# EAGLE design voltametry (EAGLE 7.7.0)
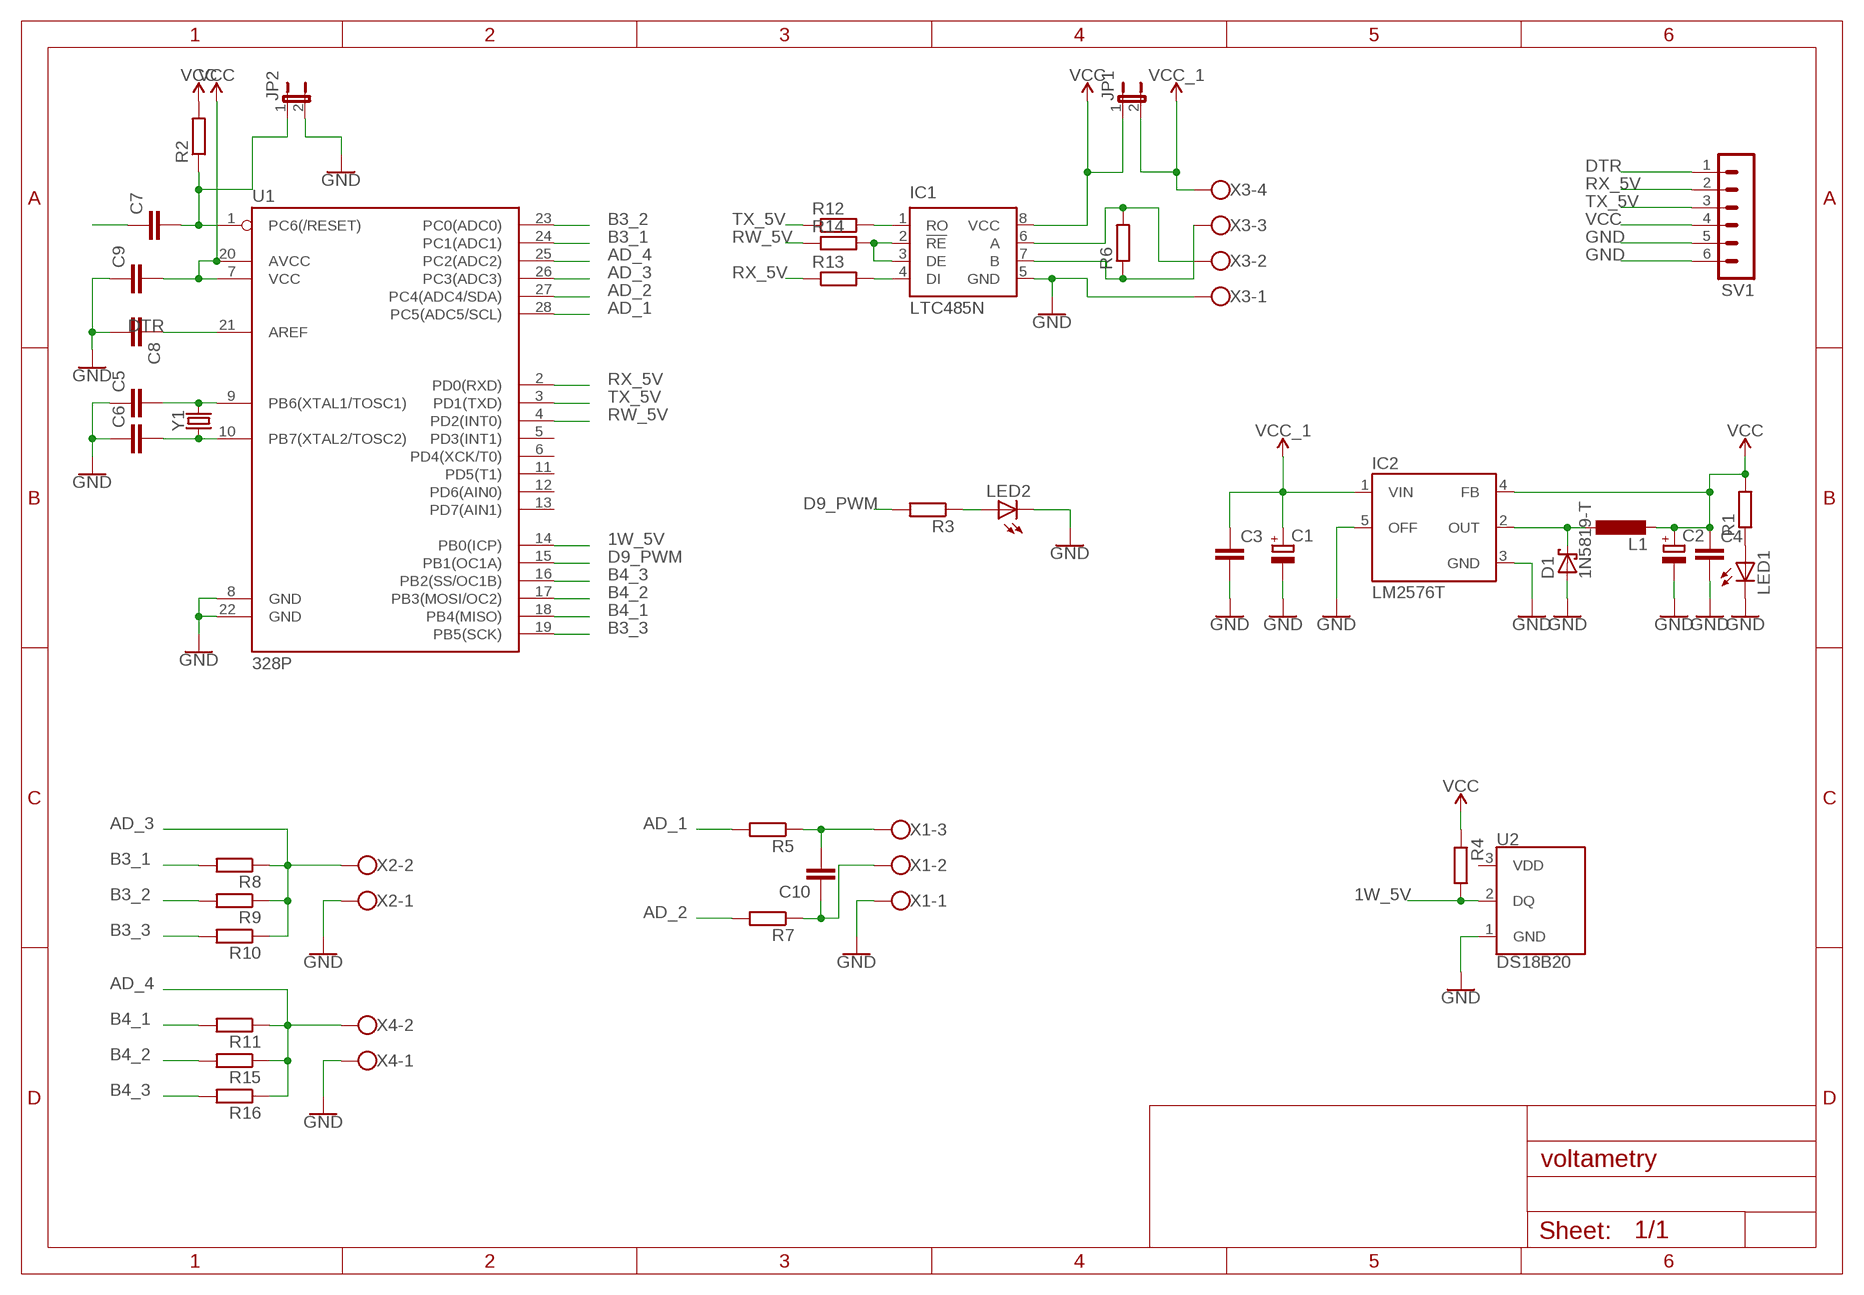
[diagram p0: schematic, sheet 1]

## Parts
C1  CPOL-EUE5-10.5  [E5-10,5]
C2  CPOL-EUE5-10.5  [E5-10,5]
C3  C-EU025-025X050  [C025-025X050]
C4  C-EU025-025X050  [C025-025X050]
C5  C-EU025-025X050  [C025-025X050]
C6  C-EU025-025X050  [C025-025X050]
C7  C-EU025-025X050  [C025-025X050]
C8  C-EU025-025X050  [C025-025X050]
C9  C-EU025-025X050  [C025-025X050]
C10  C-EU025-025X050  [C025-025X050]
D1  1N5819-T  [DO41-7.6]
IC1  LTC485N  [DIL08]
IC2  LM2576T  [TO220-5]
JP1  JP1E  [JP1]
JP2  JP1E  [JP1]
L1  L-EUTJ3-U1  [TJ3-U1]
LED1  LED5MM  [LED5MM]
LED2  LED5MM  [LED5MM]
R1  R-EU_0204/7  [0204/7]
R2  R-EU_0204/7  [0204/7]
R3  R-EU_0204/7  [0204/7]
R4  R-EU_0204/7  [0204/7]
R5  R-EU_0204/7  [0204/7]
R6  R-EU_0204/7  [0204/7]
R7  R-EU_0204/7  [0204/7]
R8  R-EU_0204/7  [0204/7]
R9  R-EU_0204/7  [0204/7]
R10  R-EU_0204/7  [0204/7]
R11  R-EU_0204/7  [0204/7]
R12  R-EU_0204/7  [0204/7]
R13  R-EU_0204/7  [0204/7]
R14  R-EU_0204/7  [0204/7]
R15  R-EU_0204/7  [0204/7]
R16  R-EU_0204/7  [0204/7]
SV1  MA06-1  [MA06-1]
U1  328P  ATMEGA328P_PDIP  [DIP28]
U2  DS18B20  [TO-92-AMMO]
X1  W237-103  [W237-103]
X2  W237-102  [W237-102]
X3  W237-4  [W237-4]
X4  W237-102  [W237-102]
Y1  CRYSTALPTH-HC49US  [HC49US]

## Nets
1W_5V: R4.2 U1.14(PB0(ICP)) U2.2(DQ)
AD_1: R5.2 U1.28(PC5(ADC5/SCL))
AD_2: R7.2 U1.27(PC4(ADC4/SDA))
AD_3: R8.1 R9.1 R10.1 U1.26(PC3(ADC3)) X2.2
AD_4: R11.1 R15.1 R16.1 U1.25(PC2(ADC2)) X4.2
B3_1: R8.2 U1.24(PC1(ADC1))
B3_2: R9.2 U1.23(PC0(ADC0))
B3_3: R10.2 U1.19(PB5(SCK))
B4_1: R11.2 U1.18(PB4(MISO))
B4_2: R15.2 U1.17(PB3(MOSI/OC2))
B4_3: R16.2 U1.16(PB2(SS/OC1B))
D9_PWM: R3.2 U1.15(PB1(OC1A))
DTR: C7.1 SV1.1
GND: C1.- C2.- C3.2 C4.2 C5.1 C6.1 C8.2 C9.1 D1.A IC1.5(GND) IC2.3(GND) IC2.5(OFF) JP2.2 LED1.K(C) LED2.K(C) SV1.5 SV1.6 U1.8(GND) U1.22(GND) U2.1(GND) X1.1 X2.1 X3.1 X4.1
N$1: LED1.A R1.1
N$2: C5.2 U1.9(PB6(XTAL1/TOSC1)) Y1.2
N$3: C6.2 U1.10(PB7(XTAL2/TOSC2)) Y1.1
N$4: IC1.4(DI) R13.2
N$5: IC1.7(B) R6.1 X3.3
N$6: C8.1 U1.21(AREF)
N$7: LED2.A R3.1
N$8: IC1.1(RO) R12.2
N$9: D1.C IC2.2(OUT) L1.1
N$10: C7.2 JP2.1 R2.1 U1.1(PC6(/RESET))
N$11: IC1.6(A) R6.2 X3.2
N$13: IC1.2(!RE) IC1.3(DE) R14.2
N$15: C10.1 R7.1 X1.2
N$16: C10.2 R5.1 X1.3
RW_5V: R14.1 U1.4(PD2(INT0))
RX_5V: R13.1 SV1.2 U1.2(PD0(RXD))
TX_5V: R12.1 SV1.3 U1.3(PD1(TXD))
VCC: C2.+ C4.1 C9.2 IC1.8(VCC) IC2.4(FB) JP1.1 L1.2 R1.2 R2.2 R4.1 SV1.4 U1.7(VCC) U1.20(AVCC)
VCC_1: C1.+ C3.1 IC2.1(VIN) JP1.2 X3.4
Unconnected: U1.5(PD3(INT1)) U1.6(PD4(XCK/T0)) U1.11(PD5(T1)) U1.12(PD6(AIN0)) U1.13(PD7(AIN1))

## Power pins joined to a net without a drawn wire
VDD: U2.3(VDD)

## Library data of the parts
C1 C2 = rcl:CPOL-EU: POLARIZED CAPACITOR, European symbol
C3-C10 = rcl:C-EU: CAPACITOR, European symbol
D1 = diode:1N581*: 1.0A SCHOTTKY BARRIER RECTIFIER Source: http://www.diodes.com/datasheets/ds23001.pdf
IC1 = linear-technology:LTC485: Low Power RS485 Interface Transceiver Source: http://www.linear.com/pc/downloadDocument.do?navId=H0,C1,C1007,C1017,P2064,D1718; OC_FARNELL: unknown; OC_NEWARK: unknown
IC2 = v-reg-3:LM2576: National Semiconductor <http://www.national.com> 3.0A "Simple Switcher"(c) 52kHz, Vout 1.23-37V (HV: 57V), Vin 40V (HV: 60V), 50µA standby current
JP1 JP2 = jumper:JP1E: JUMPER
L1 = resistor:L-EU: INDUCTOR, European symbol
LED1 LED2 = led:LED: LED OSRAM: - CHIPLED LG R971, LG N971, LY N971, LG Q971, LY Q971, LO R971, LY R971 LH N974, LH R974 LS Q976, LO Q976, LY Q976 LO Q996 - Hyper CHIPLED LW Q18S LB Q993, LB Q99A, LB R99A - SideLED LS A670, LO A670, LY A670, LG A670, LP A670 LB A673, LV A673, LT A673, LW A673 LH A674 LY A675 LS A676, LA A676, LO A676, LY A676, LW A676 LS A679, LY A679, LG A679 - Hyper Micro SIDELED® LS Y876, LA Y876, LO Y876, LY Y876 LT Y87S - SmartLED LW L88C, LW L88S LB L89C, LB L89S, LG L890 LS L89K, LO L89K, LY L89K LS L896, LA L896, LO L896, LY L896 - TOPLED LS T670, LO T670, LY T670, LG T670, LP T670 LSG T670, LSP T670, LSY T670, LOP T670, LYG T670 LG T671, LOG T671, LSG T671 LB T673, LV T673, LT T673, LW T673 LH T674 LS T676, LA T676, LO T676, LY T676, LB T676, LH T676, LSB T676, LW T676 LB T67C, LV T67C, LT T67C, LS T67K, LO T67K, LY T67K, LW E67C LS E67B, LA E67B, LO E67B, LY E67B, LB E67C, LV E67C, LT E67C LW T67C LS T679, LY T679, LG T679 LS T770, LO T770, LY T770, LG T770, LP T770 LB T773, LV T773, LT T773, LW T773 LH T774 LS E675, LA E675, LY E675, LS T675 LS T776, LA T776, LO T776, LY T776, LB T776 LHGB T686 LT T68C, LB T68C - Hyper Mini TOPLED® LB M676 - Mini TOPLED Santana® LG M470 LS M47K, LO M47K, LY M47K Source: http://www.osram.convergy.de LUXEON: - LUMILED® LXK2-PW12-R00, LXK2-PW12-S00, LXK2-PW14-U00, LXK2-PW14-V00 LXK2-PM12-R00, LXK2-PM12-S00, LXK2-PM14-U00 LXK2-PE12-Q00, LXK2-PE12-R00, LXK2-PE12-S00, LXK2-PE14-T00, LXK2-PE14-U00 LXK2-PB12-K00, LXK2-PB12-L00, LXK2-PB12-M00, LXK2-PB14-N00, LXK2-PB14-P00, LXK2-PB14-Q00 LXK2-PR12-L00, LXK2-PR12-M00, LXK2-PR14-Q00, LXK2-PR14-R00 LXK2-PD12-Q00, LXK2-PD12-R00, LXK2-PD12-S00 LXK2-PH12-R00, LXK2-PH12-S00 LXK2-PL12-P00, LXK2-PL12-Q00, LXK2-PL12-R00 Source: www.luxeon.com KINGBRIGHT: KA-3528ASYC Source: www.kingbright.com
R1-R16 = rcl:R-EU_: RESISTOR, European symbol
SV1 = con-lstb:MA06-1: PIN HEADER; OC_FARNELL: unknown; OC_NEWARK: unknown
U1 = SparkFun-IC-Microcontroller:ATMEGA328P_PDIP: Atmel 328P Through hole ATMEGA328P uC used in the Arduino 32kb flash, 1k EEPROM, 2k SRAM Datasheet <http://www.sparkfun.com/datasheets/Components/SMD/ATMega328.pdf> SparkFun Products Storefront component: AVR 28 Pin 20MHz 32K 6A/D - ATMega328P <https://www.sparkfun.com/products/9061> (COM-09061) SparkFun Simon Says - Through-Hole Soldering Kit <https://www.sparkfun.com/products/10547> (KIT-10547) SparkFun Learn to Solder - Simon Says <https://www.sparkfun.com/products/13708> (KIT-13708) SparkFun BigTime Watch Kit <https://www.sparkfun.com/products/11734> (KIT-11734) SparkFun ClockIt <https://www.sparkfun.com/products/10930> (KIT-10930) SparkFun Serial Enabled LCD Kit <https://www.sparkfun.com/products/10097> (LCD-10097) SparkFun Simon Tilts - Through Hole Soldering Kit <https://www.sparkfun.com/products/12634> (KIT-12634) SparkFun Frequency Counter Kit <https://www.sparkfun.com/products/10140> (KIT-10140) FabFM Radio Kit <https://www.sparkfun.com/products/11043> (KIT-11043) SparkFun Binary Blaster Kit <https://www.sparkfun.com/products/12037> (KIT-12037) SparkFun Metro-Gnome <https://www.sparkfun.com/products/9236> (KIT-09236) ATmega328 with Arduino Optiboot (Uno) <https://www.sparkfun.com/products/10524> (DEV-10524); PROD_ID: IC-09136
U2 = SparkFun-Sensors:DS18B20: Dallas/Maxim DS18B20 1-Wire Temperature Sensor The DS18B20 reports degrees C with 9 to 12-bit precision, -55C to 125C (+/-0.5C). Each sensor has a unique 64-Bit Serial number etched into it - allows for a huge number of sensors to be used on one data bus. Datasheet <http://datasheets.maximintegrated.com/en/ds/DS18B20.pdf> SparkFun Products One Wire Digital Temperature Sensor - DS18B20 <https://www.sparkfun.com/products/245> (SEN-00245); STORE_ID: SEN-00245
X1 = con-wago-500:W237-103: WAGO SCREW CLAMP; MPN: 237-103; OC_FARNELL: unknown; OC_NEWARK: 18M7116
X2 X4 = con-wago-500:W237-102: WAGO SCREW CLAMP; MPN: 237-102; OC_FARNELL: unknown; OC_NEWARK: 70K9898
X3 = con-wago-500:W237-4: WAGO SCREW CLAMP; OC_FARNELL: unknown; OC_NEWARK: unknown
Y1 = SparkFun-Clocks:CRYSTAL: Crystals (Generic) These are passive quartz crystals, which can be used as a clock source for a microcontroller. Crystal's are two-terminal devices. They require external "load" capacitors to generate an oscillating signal.

## Board
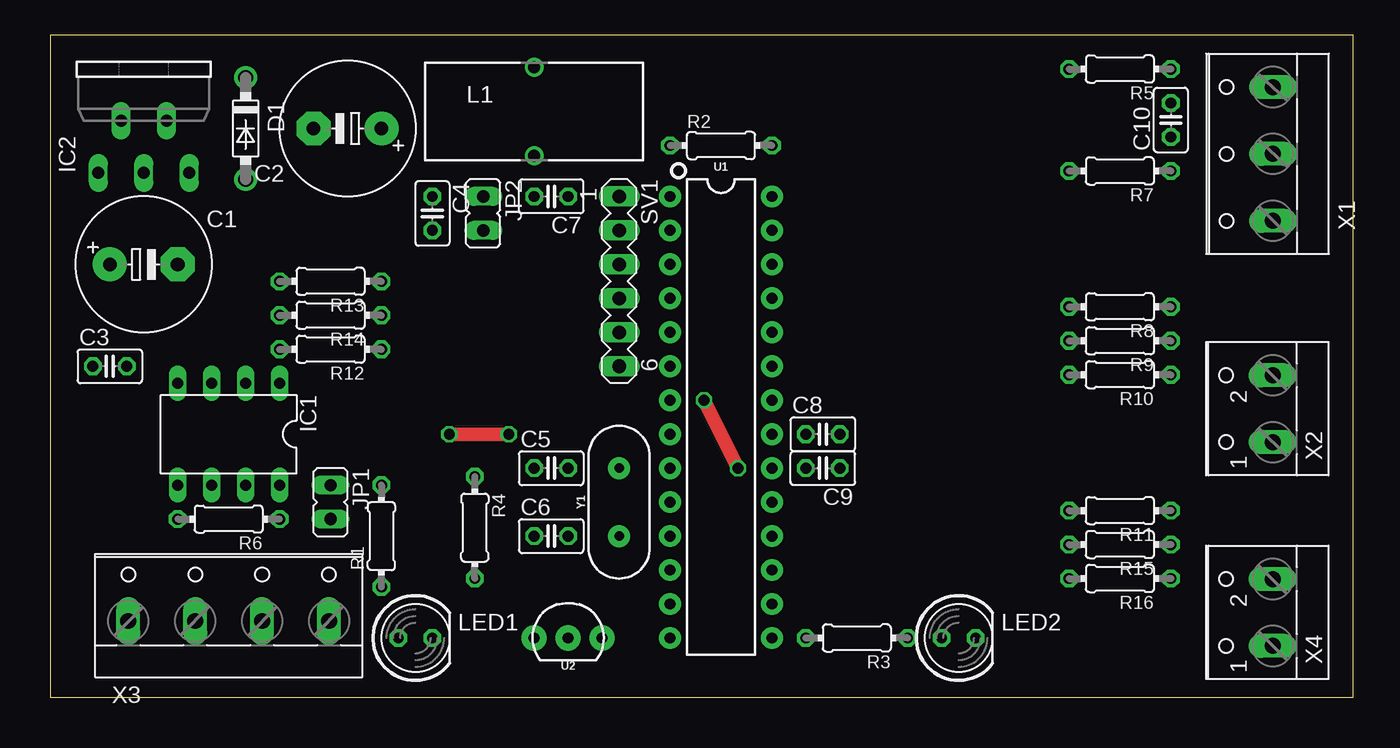
[diagram p1: board, top side]
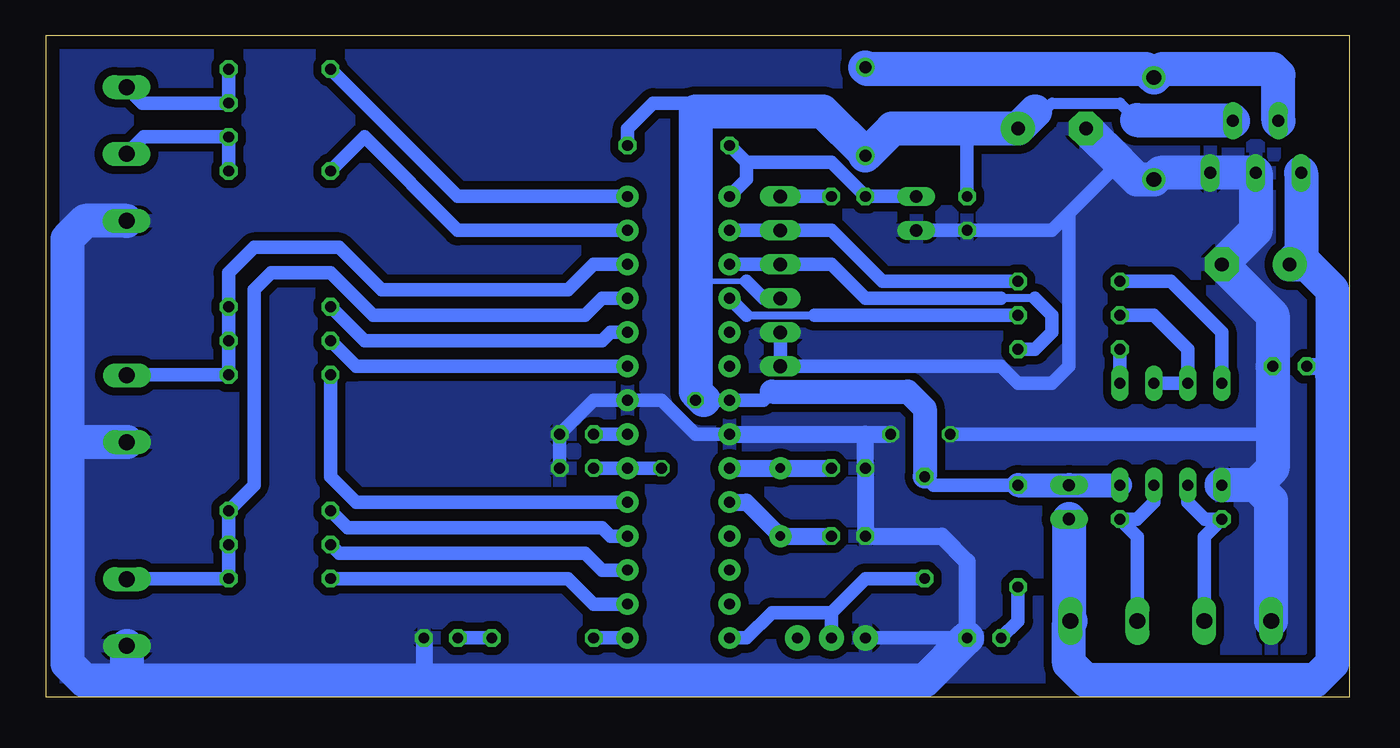
[diagram p2: board, bottom side, seen from below]

Size 97.46 x 49.52 mm. Coordinates in mm from the lower left corner, seen from the top.
Outline: 0,0 97.46,0 97.46,49.52 0,49.52 0,0
Copper layers (1*16): Top 0.035mm / dielectric 1.5mm / Bottom 0.035mm
Design rules "default": minimum track width 10mil, minimum drill 24mil, track to track 8mil, track to pad 8mil, pad to pad 8mil, via to via 8mil, smd to smd 8mil, copper to edge 40mil, drill to drill 8mil, minimum pad ring 10mil, minimum via ring 8mil, stop-mask expansion 4mil, vias tented up to drill 0mil, thermal gap 10mil

### Footprints (pad centres in the part's own frame; a part is rotated, then mirrored left to right if it is on the bottom)
E5-10,5 = drill 1.016 pad 2.54: + -2.54,0 | drill 1.016 pad 2.54 octagon: - 2.54,0
C025-025X050 = drill 0.813 octagon: 1 -1.27,0; 2 1.27,0
DO41-7.6 = drill 1.1 pad 1.7: A 3.81,0; C -3.81,0
DIL08 = drill 0.813 long: 1 -3.81,-3.81; 2 -1.27,-3.81; 3 1.27,-3.81; 4 3.81,-3.81; 5 3.81,3.81; 6 1.27,3.81; 7 -1.27,3.81; 8 -3.81,3.81
TO220-5 = drill 0.9 long: 1 -3.4,-8.4; 2 -1.7,-4.5; 3 0,-8.4; 4 1.7,-4.5; 5 3.4,-8.4
JP1 = drill 0.914 long: 1 0,-1.27; 2 0,1.27
TJ3-U1 = drill 0.9: 1 -3.3,0; 2 3.3,0
LED5MM = drill 0.813 octagon: A -1.27,0; K 1.27,0
0204/7 = drill 0.813 octagon: 1 -3.81,0; 2 3.81,0
MA06-1 = drill 1.016 long: 1 -6.35,0; 2 -3.81,0; 3 -1.27,0; 4 1.27,0; 5 3.81,0; 6 6.35,0
DIP28 = drill 0.813 pad 1.626: 1 -16.51,-3.81; 2 -13.97,-3.81; 3 -11.43,-3.81; 4 -8.89,-3.81; 5 -6.35,-3.81; 6 -3.81,-3.81; 7 -1.27,-3.81; 8 1.27,-3.81; 9 3.81,-3.81; 10 6.35,-3.81; 11 8.89,-3.81; 12 11.43,-3.81; 13 13.97,-3.81; 14 16.51,-3.81; 15 16.51,3.81; 16 13.97,3.81; 17 11.43,3.81; 18 8.89,3.81; 19 6.35,3.81; 20 3.81,3.81; 21 1.27,3.81; 22 -1.27,3.81; 23 -3.81,3.81; 24 -6.35,3.81; 25 -8.89,3.81; 26 -11.43,3.81; 27 -13.97,3.81; 28 -16.51,3.81
TO-92-AMMO = drill 0.813 pad 1.88: 1 -2.54,0; 2 0,0; 3 2.54,0
W237-103 = drill 1.194 long: 1 -5,-1.29; 2 0,-1.29; 3 5,-1.29
W237-102 = drill 1.194 long: 1 -2.5,-1.27; 2 2.5,-1.27
W237-4 = drill 1.194 long: 1 -7.5,-1.27; 2 -2.5,-1.27; 3 2.5,-1.27; 4 7.5,-1.27
HC49US = drill 0.7 pad 1.651: 1 -2.54,0; 2 2.54,0

### Placement (x,y rotation side)
C1  6.99,32.38 0 top
C2  22.23,42.55 180 top
C3  4.45,24.77 0 top
C4  28.57,36.2 270 top
C5  37.47,17.14 0 top
C6  37.47,12.06 0 top
C7  37.47,37.47 180 top
C8  57.78,19.68 0 top
C9  57.78,17.14 180 top
C10  83.82,43.18 90 top
D1  14.61,42.55 270 top
IC1  13.34,19.68 180 top
IC2  6.99,47.62 0 top
JP1  20.95,14.61 180 top
JP2  32.38,36.2 180 top
L1  36.2,43.81 270 top
LED1  27.3,4.45 0 top
LED2  67.94,4.45 0 top
R1  24.77,12.06 90 top
R2  50.16,41.27 0 top
R3  60.33,4.45 180 top
R4  31.75,12.7 270 top
R5  80.01,46.99 180 top
R6  13.34,13.34 180 top
R7  80.01,39.37 180 top
R8  80.01,29.21 180 top
R9  80.01,26.67 180 top
R10  80.01,24.13 180 top
R11  80.01,13.97 180 top
R12  20.95,26.04 180 top
R13  20.95,31.11 180 top
R14  20.95,28.57 180 top
R15  80.01,11.43 180 top
R16  80.01,8.89 180 top
SV1  42.55,31.11 270 top
U1  50.16,20.95 270 top
U2  38.73,4.45 0 top
X1  90.17,40.64 90 top
X2  90.17,21.59 90 top
X3  13.34,6.99 0 top
X4  90.17,6.35 90 top
Y1  42.55,14.61 90 top

### Tracks (layer width: path | path; a pad name or v marks a point on that pad's centre or on a via)
1W_5V
  Bottom 1.016: R4.2 36.2,8.89 38.73,6.35 | 38.73,6.35 U2.2 | U1.14 45.09,4.45 43.18,6.35 38.73,6.35
AD_1
  Bottom 1.016: U1.28 66.67,37.47 R5.2
AD_2
  Bottom 1.016: U1.27 66.67,34.92 73.66,41.91 R7.2
AD_3
  Bottom 1.016: X2.2 91.4,24.13 R10.1 R9.1 R8.1 83.82,31.75 81.92,33.66 75.56,33.66 72.39,30.48 58.42,30.48 56.52,32.38 U1.26
AD_4
  Bottom 1.016: X4.2 91.4,8.89 R16.1 R15.1 R11.1 81.92,15.88 81.92,30.48 80.64,31.75 76.2,31.75 73.03,28.57 57.15,28.57 55.88,29.84 U1.25
B3_1
  Bottom 1.016: U1.24 55.24,27.3 55.88,26.67 73.66,26.67 R8.2
B3_2
  Bottom 1.016: U1.23 74.3,24.77 R9.2
B3_3
  Bottom 1.016: U1.19 74.3,14.61 76.2,16.51 R10.2
B4_1
  Bottom 1.016: U1.18 55.24,12.06 55.88,12.7 74.93,12.7 R11.2
B4_2
  Bottom 1.016: U1.17 55.88,9.53 57.15,10.79 75.56,10.79 R15.2
B4_3
  Bottom 1.016: U1.16 56.52,6.99 58.42,8.89 R16.2
D9_PWM
  Bottom 1.016: U1.15 R3.2
DTR
  Bottom 1.016: SV1.1 C7.1
GND  (via drill 0.8)
  Top 1.016: v34.29,19.68 v29.84,19.68
  Bottom 1.016: JP2.2 C4.2 22.23,34.92 20.95,36.2 | 20.95,36.2 17.14,40.01 | 20.95,36.2 20.95,24.77 22.23,23.5 24.77,23.5 26.04,24.77 SV1.6 SV1.5 | v29.84,19.68 5.71,19.68 | U2.1 LED1.K | C9.1 C8.2 56.52,22.23 U1.22 51.44,22.23 48.9,19.68 U1.8
  Bottom 1.27: U1.8 36.2,19.68 | 36.2,19.68 v34.29,19.68 | 36.2,19.68 C5.1 C6.1 30.48,12.06 28.57,10.16 LED1.K | LED2.K 69.22,1.27
  Bottom 2.54: C2.- 17.14,40.01 15.88,38.73 D1.A 14.12,39.23 IC2.5 IC2.3 6.99,34.92 C1.- 5.71,28.57 C3.2 5.71,19.68 5.71,17.14 6.99,15.88 | X3.1 5.83,14.72 6.99,15.88 | 6.99,15.88 IC1.5 | X1.1 94.53,35.64 95.89,34.29 95.89,19.05 | 95.89,19.05 95.89,2.54 94.61,1.27 91.44,1.27 | 91.44,1.27 69.22,1.27 31.75,1.27 LED1.K | X2.1 95.84,19.09 95.89,19.05 | X4.1 91.44,1.27
  pour Bottom (isolate 0.61): 0,49.53 97.79,49.53 97.79,0 0,0
N$1
  Bottom 1.016: LED1.A 24.77,5.71 R1.1
N$2
  Bottom 1.27: U1.9 Y1.2 C5.2
N$3
  Bottom 1.27: U1.10 45.09,14.61 Y1.1 C6.2
N$4
  Bottom 1.016: R13.2 13.34,31.11 9.53,27.3 IC1.4
N$5
  Bottom 1.016: X3.3 15.84,12.03 R6.1 15.88,13.34 14.61,14.61 IC1.7
N$6
  Bottom 1.016: C8.1 U1.21
N$7
  Bottom 1.016: R3.1 LED2.A
N$8
  Bottom 1.016: R12.2 IC1.1
N$9
  Bottom 2.54: IC2.2 5.29,46.56 5.71,46.99 13.97,46.99 D1.C 15.24,46.99 36.07,46.99 L1.1
N$10
  Bottom 1.016: JP2.1 C7.2 38.73,40.01 45.09,40.01 | U1.1 45.09,38.73 45.09,40.01 | 45.09,40.01 R2.1
N$11
  Bottom 1.016: IC1.6 12.06,14.61 10.79,13.34 R6.2 10.84,12.03 X3.2
N$13
  Bottom 1.016: R14.2 14.61,28.57 12.06,26.04 IC1.3 IC1.2
N$15
  Bottom 1.016: R7.1 C10.1 90.19,41.91 X1.2
N$16
  Bottom 1.016: X1.3 90.27,44.45 C10.2 R5.1
RW_5V
  Bottom 0.61: 45.09,28.57 40.01,28.57
  Bottom 1.016: U1.4 45.09,28.57 | 40.01,28.57 R14.1
RX_5V
  Bottom 1.016: U1.2 SV1.2 38.73,34.92 34.92,31.11 R13.1
TX_5V
  Bottom 0.61: 23.5,29.84 26.04,29.84
  Bottom 1.016: U1.3 SV1.3 38.73,32.38 36.2,29.84 26.04,29.84 | 23.5,29.84 22.23,28.57 22.23,27.3 23.5,26.04 R12.1
VCC  (via drill 0.8)
  Top 1.016: v51.44,17.14 v48.9,22.23
  Bottom 0.406: 45.09,31.11 48.26,31.11 48.9,30.48
  Bottom 0.813: 23.5,43.81 22.86,43.81 22.23,44.45 17.14,44.45 15.88,43.18
  Bottom 1.016: 31.75,41.91 32.38,42.55 | C4.1 28.57,42.55 | 43.18,22.86 43.81,22.23 U1.7 48.26,22.23 | R2.2 53.98,42.55 52.07,44.45 49.53,44.45 48.9,43.81 | SV1.4 43.81,29.84 45.09,31.11 | v51.44,17.14 U1.20 C9.2 | v48.9,22.23 49.53,24.13 48.9,24.13 | R1.2 31.11,15.88 R4.1
  Bottom 1.778: 43.18,22.86 33.02,22.86 31.75,21.59 R4.1 | R1.2 JP1.1 IC1.8
  Bottom 2.54: 23.5,43.81 C2.+ 28.57,42.55 32.38,42.55 34.16,42.55 L1.2 36.2,40.64 39.37,43.81 48.9,43.81 48.9,30.48 48.9,24.13 48.9,22.86 48.26,22.23 | 15.88,43.18 8.74,43.18 IC2.4
VCC_1
  Bottom 1.27: C3.1 1.91,24.77 1.27,24.13
  Bottom 2.54: IC2.1 3.58,33.24 C1.+ 3.17,32.38 1.27,30.48 1.27,24.13 1.27,2.54 2.54,1.27 19.68,1.27 20.95,2.54 20.95,5.59 X3.4 20.95,5.83 JP1.2